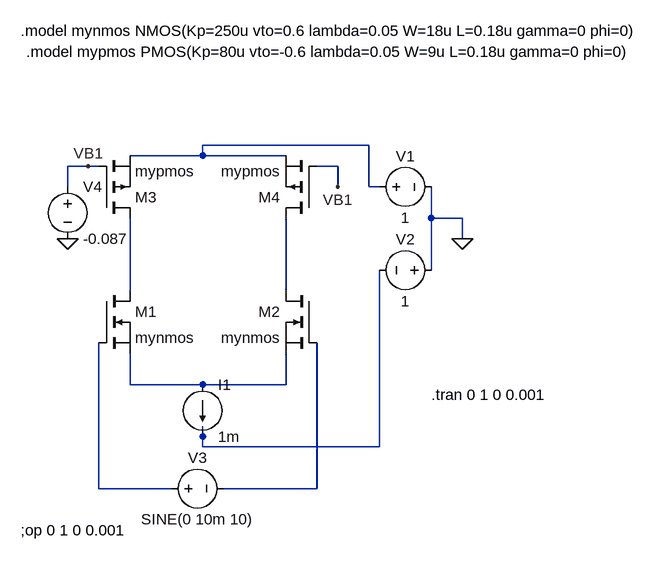
[diagram p0: schematic 2.asc]
2.asc, the LTspice schematic file:
Version 4
SHEET 1 1268 704
WIRE 352 32 96 32
WIRE 96 48 96 32
WIRE 96 48 -16 48
WIRE 224 48 96 48
WIRE -80 64 -112 64
WIRE -64 64 -80 64
WIRE 304 64 272 64
WIRE -112 96 -112 64
WIRE 304 96 304 64
WIRE 352 96 352 32
WIRE 368 96 352 96
WIRE 448 144 448 96
WIRE 496 144 448 144
WIRE 496 176 496 144
WIRE 448 224 448 144
WIRE -16 256 -16 144
WIRE 224 256 224 144
WIRE -16 400 -16 352
WIRE 96 400 -16 400
WIRE 224 400 224 352
WIRE 224 400 96 400
WIRE 96 480 96 464
WIRE 96 496 96 480
WIRE 368 496 368 224
WIRE 368 496 96 496
WIRE -64 560 -64 336
WIRE 48 560 -64 560
WIRE 272 560 272 336
WIRE 272 560 128 560
FLAG 496 176 0
FLAG 304 96 VB1
FLAG -112 176 0
FLAG -80 64 VB1
DATAFLAG 224 192 ""
DATAFLAG -16 208 ""
DATAFLAG 160 400 ""
SYMBOL nmos -64 256 R0
SYMATTR InstName M1
SYMATTR Value mynmos
SYMBOL nmos 272 256 M0
SYMATTR InstName M2
SYMATTR Value mynmos
SYMBOL pmos -64 144 M180
SYMATTR InstName M3
SYMATTR Value mypmos
SYMBOL pmos 272 144 R180
SYMATTR InstName M4
SYMATTR Value mypmos
SYMBOL voltage 352 96 R270
WINDOW 0 32 56 VTop 2
WINDOW 3 -32 56 VBottom 2
WINDOW 123 0 0 Left 0
WINDOW 39 0 0 Left 0
SYMATTR InstName V1
SYMATTR Value 1
SYMBOL voltage 464 224 R90
WINDOW 0 -32 56 VBottom 2
WINDOW 3 32 56 VTop 2
WINDOW 123 0 0 Left 0
WINDOW 39 0 0 Left 0
SYMATTR InstName V2
SYMATTR Value 1
SYMBOL current 96 400 R0
WINDOW 123 0 0 Left 0
WINDOW 39 0 0 Left 0
SYMATTR InstName I1
SYMATTR Value 1m
SYMBOL voltage -112 80 R0
WINDOW 123 0 0 Left 0
WINDOW 39 0 0 Left 0
SYMATTR InstName V4
SYMATTR Value -0.087
SYMBOL voltage 32 560 R270
WINDOW 0 32 56 VTop 2
WINDOW 3 -32 56 VBottom 2
WINDOW 123 0 0 Left 0
WINDOW 39 0 0 Left 0
SYMATTR InstName V3
SYMATTR Value SINE(0 10m 10)
TEXT -184 -144 Left 2 !.model mynmos NMOS(Kp=250u vto=0.6 lambda=0.05 W=18u L=0.18u gamma=0 phi=0)
TEXT -184 624 Left 2 !;op 0 1 0 0.001
TEXT 448 416 Left 2 !.tran 0 1 0 0.001
TEXT -176 -112 Left 2 !.model mypmos PMOS(Kp=80u vto=-0.6 lambda=0.05 W=9u L=0.18u gamma=0 phi=0)

The netlist it stands for:
* 2.asc
M1 N002 N006 N004 N004 mynmos
M2 N003 N007 N004 N004 mynmos
M3 N002 VB1 N001 N001 mypmos
M4 N003 VB1 N001 N001 mypmos
V1 N001 0 1
V2 0 N005 1
I1 N004 N005 1m
V4 VB1 0 -0.087
V3 N006 N007 SINE(0 10m 10)
.model NMOS NMOS
.model PMOS PMOS
.lib standard.mos
.model mynmos NMOS(Kp=250u vto=0.6 lambda=0.05 W=18u L=0.18u gamma=0 phi=0)
;op 0 1 0 0.001
.tran 0 1 0 0.001
.model mypmos PMOS(Kp=80u vto=-0.6 lambda=0.05 W=9u L=0.18u gamma=0 phi=0)
.backanno
.end